# Altium schematic sheet P03_SOM CONNECTOR.SchDoc
size 594 x 420 mm
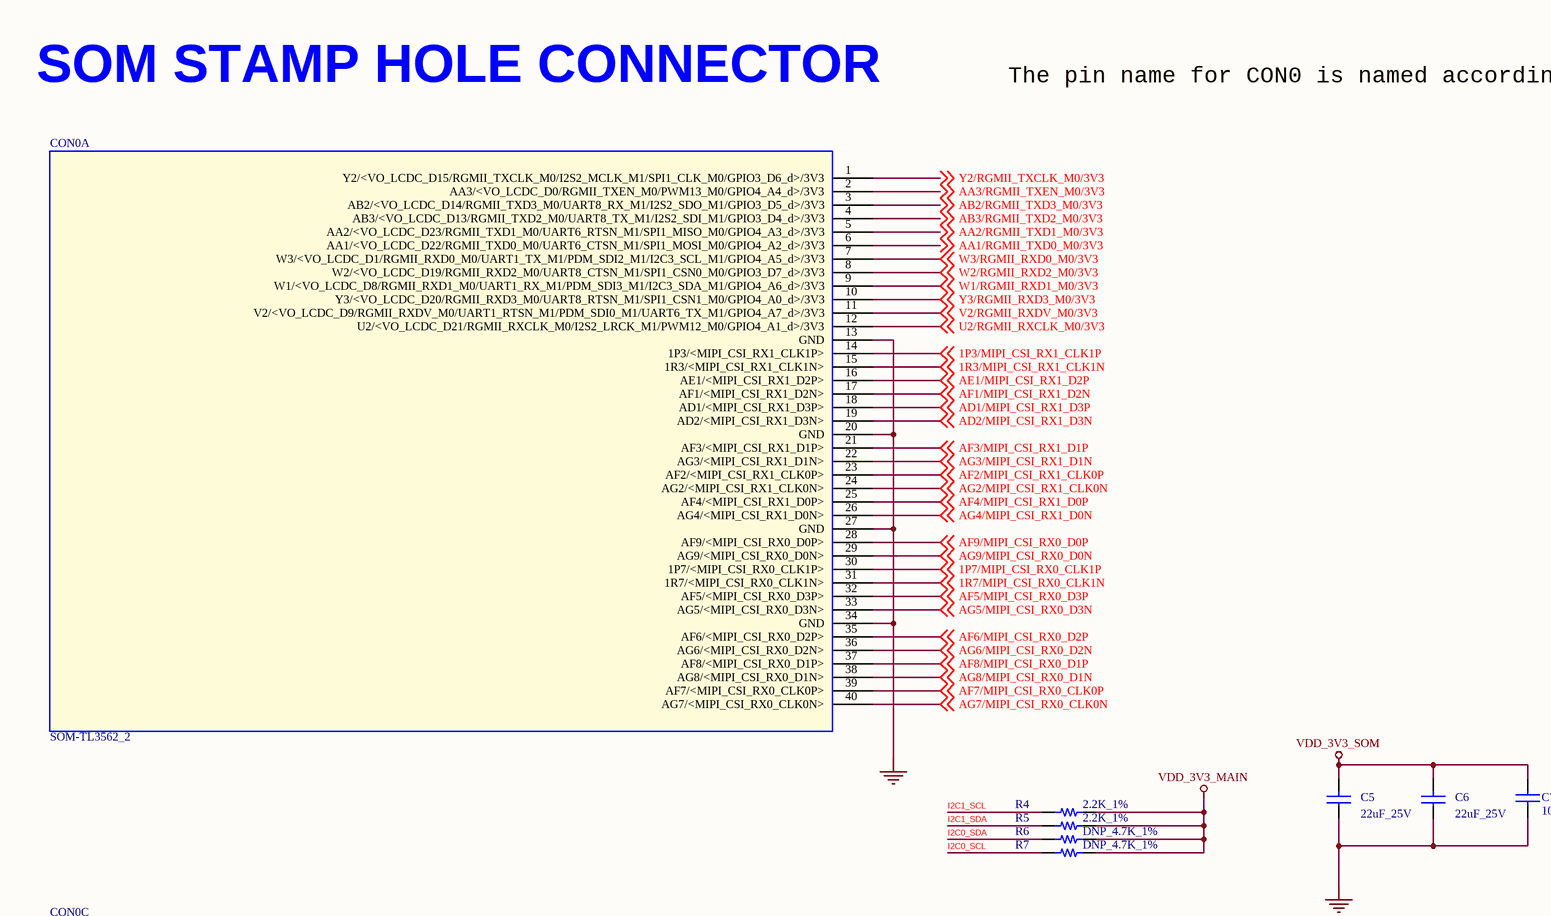
[diagram p0: P03_SOM CONNECTOR.SchDoc, top left]
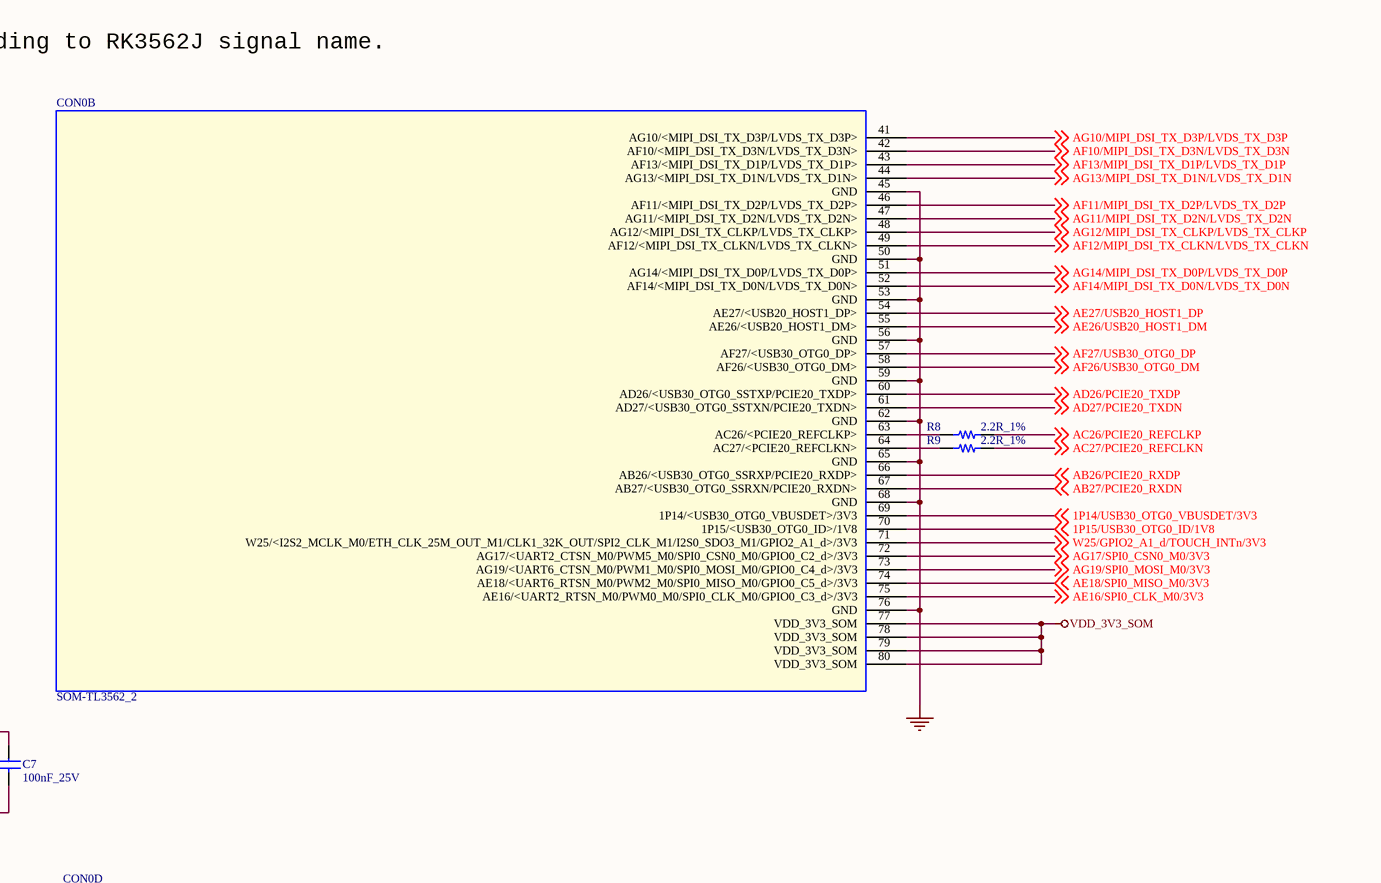
[diagram p1: P03_SOM CONNECTOR.SchDoc, top right]
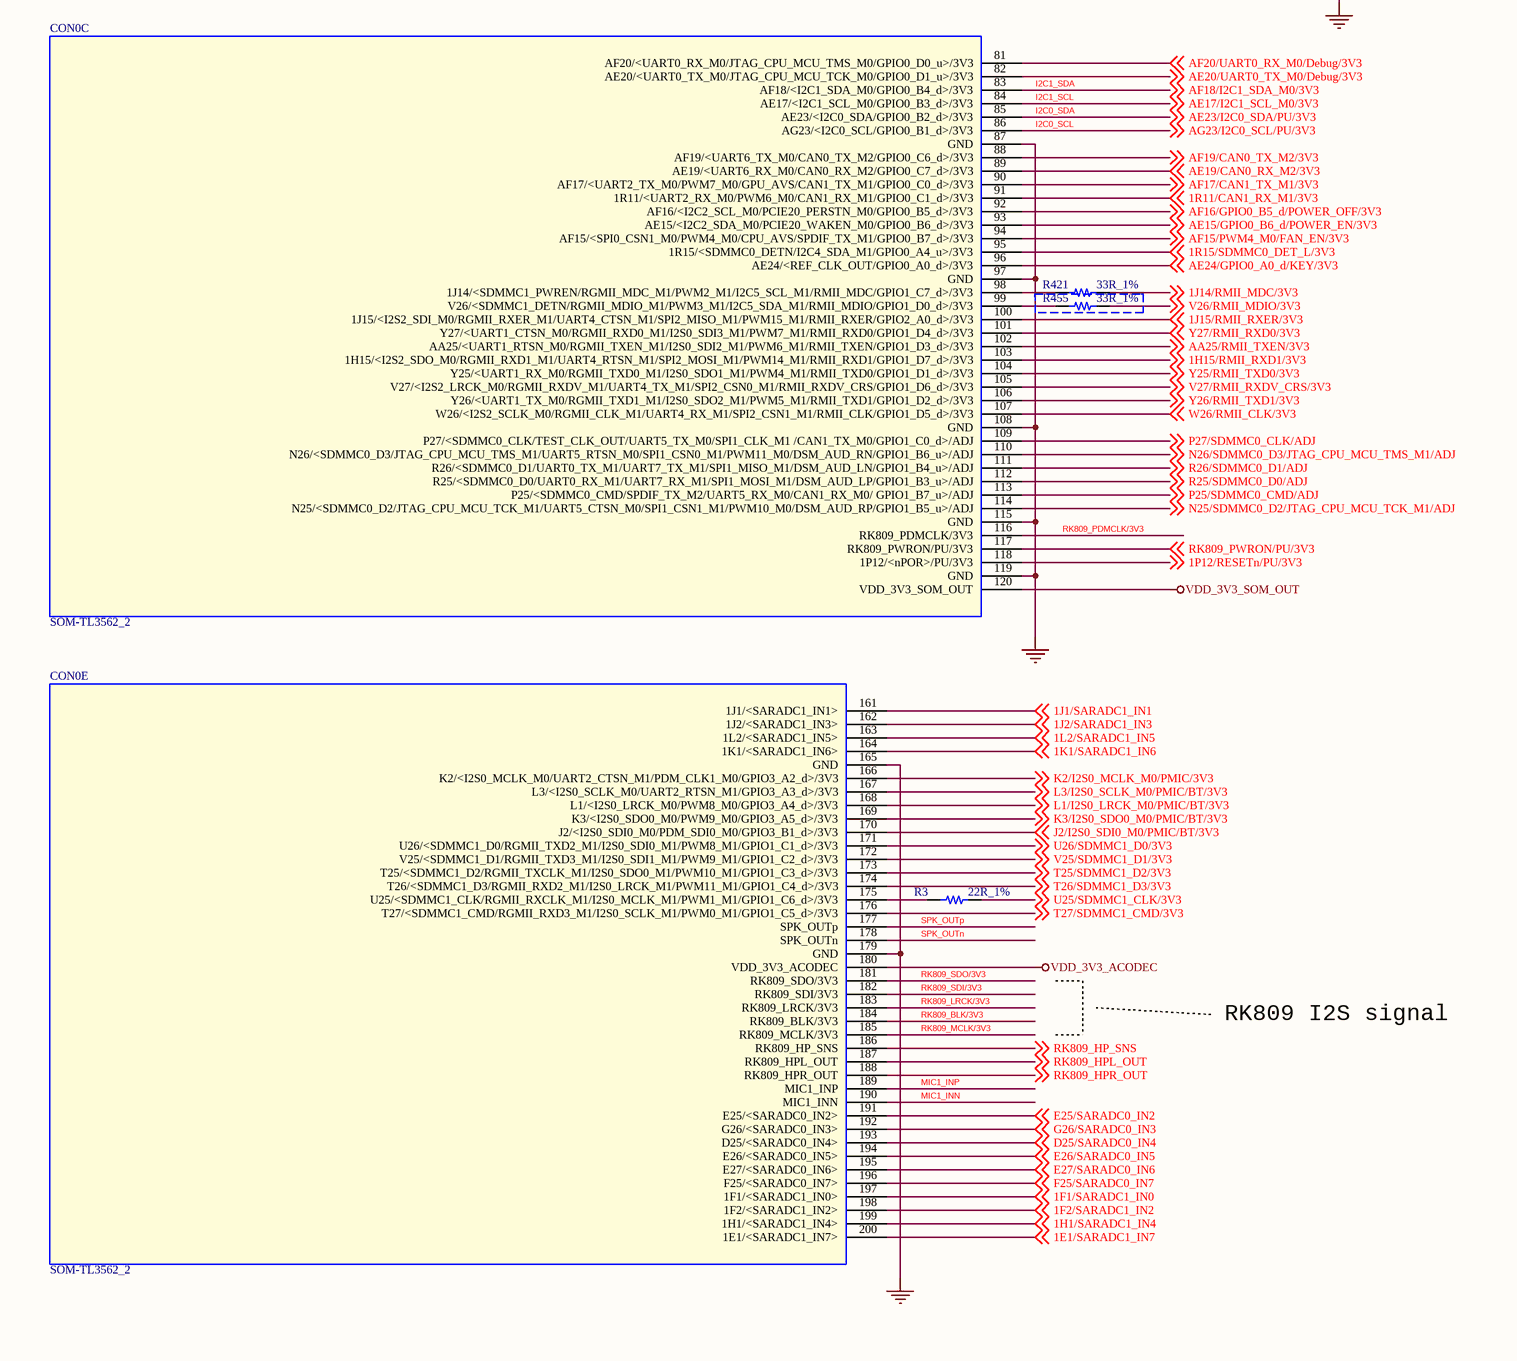
[diagram p2: P03_SOM CONNECTOR.SchDoc, bottom left]
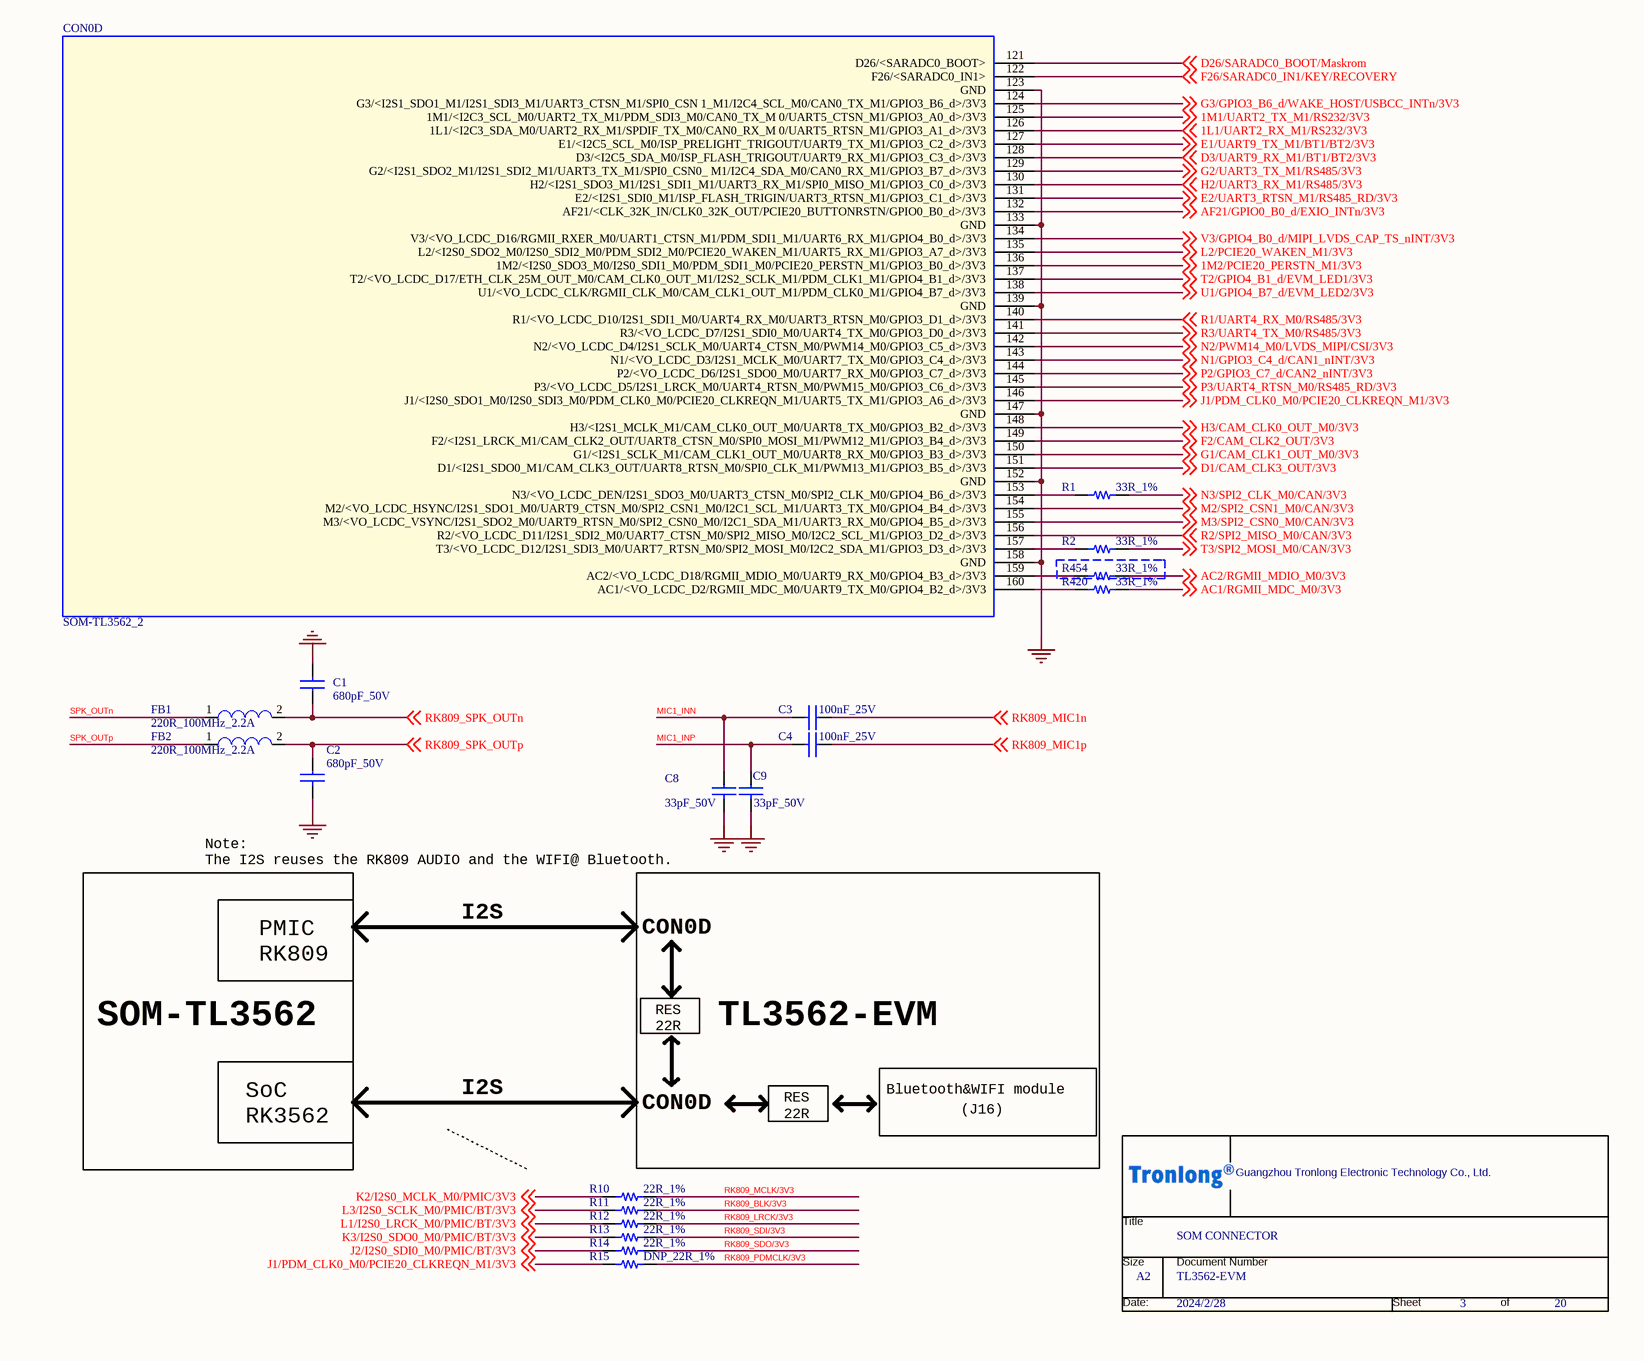
[diagram p3: P03_SOM CONNECTOR.SchDoc, bottom right]

## Parts
*  Page Count: 20  Page Number: 3  Page Size: A2  OrgName: Guangzhou Tronlong Electronic Technology Co., Ltd.  Title: SOM CONNECTOR  Doc: TL3562-EVM  Page Modify Date: 2024/2/28  (hidden comment: Tronlong_TITTLE_20211115)  (graphical)
C1  680pF_50V  [C0603]
C2  680pF_50V  [C0603]
C3  100nF_25V  [C0402]
C4  100nF_25V  [C0402]
C5  22uF_25V  [C0805]
C6  22uF_25V  [C0805]
C7  100nF_25V  [C0402]
C8  33pF_50V  [C0603]
C9  33pF_50V  [C0603]
CON0  SOM-TL3562_2  [SMD_200P_45x45_TL3562]  (parts A,B,C,D,E of 5)
FB1  220R_100MHz_2.2A  [L0603]
FB2  220R_100MHz_2.2A  [L0603]
R1  33R_1%  [R0402]
R2  33R_1%  [R0402]
R3  22R_1%  [R0402]
R4  2.2K_1%  [R0603]
R5  2.2K_1%  [R0603]
R6  DNP_4.7K_1%  [R0402]
R7  DNP_4.7K_1%  [R0402]
R8  2.2R_1%  [R0402]
R9  2.2R_1%  [R0402]
R10  22R_1%  [R0402]
R11  22R_1%  [R0402]
R12  22R_1%  [R0402]
R13  22R_1%  [R0402]
R14  22R_1%  [R0402]
R15  DNP_22R_1%  [R0402]
R420  33R_1%  [R0402]
R421  33R_1%  [R0402]
R454  33R_1%  [R0402]
R455  33R_1%  [R0402]

## Nets
GND: C1.2 C2.2 C5.1 C6.1 C7.2 C8.2 C9.2 CON0.13(GND) CON0.20(GND) CON0.27(GND) CON0.34(GND) CON0.45(GND) CON0.50(GND) CON0.53(GND) CON0.56(GND) CON0.59(GND) CON0.62(GND) CON0.65(GND) CON0.68(GND) CON0.76(GND) CON0.87(GND) CON0.97(GND) CON0.108(GND) CON0.115(GND) CON0.119(GND) CON0.123(GND) CON0.133(GND) CON0.139(GND) CON0.147(GND) CON0.152(GND) CON0.158(GND) CON0.165(GND) CON0.179(GND)
VDD_3V3_ACODEC: CON0.180(VDD_3V3_ACODEC)
VDD_3V3_MAIN: R4.2 R5.2 R6.2 R7.2
VDD_3V3_SOM: C5.2 C6.2 C7.1 CON0.77(VDD_3V3_SOM) CON0.78(VDD_3V3_SOM) CON0.79(VDD_3V3_SOM) CON0.80(VDD_3V3_SOM)
VDD_3V3_SOM_OUT: CON0.120(VDD_3V3_SOM_OUT)
1E1/SARADC1_IN7: CON0.200(1E1/<SARADC1_IN7>) ; off-sheet 1E1/SARADC1_IN7
1F1/SARADC1_IN0: CON0.197(1F1/<SARADC1_IN0>) ; off-sheet 1F1/SARADC1_IN0
1F2/SARADC1_IN2: CON0.198(1F2/<SARADC1_IN2>) ; off-sheet 1F2/SARADC1_IN2
1H1/SARADC1_IN4: CON0.199(1H1/<SARADC1_IN4>) ; off-sheet 1H1/SARADC1_IN4
1H15/RMII_RXD1/3V3: CON0.103(1H15/<I2S2_SDO_M0/RGMII_RXD1_M1/UART4_RTSN_M1/SPI2_MOSI_M1/PWM14_M1/RMII_RXD1/GPIO1_D7_d>/3V3) ; off-sheet 1H15/RMII_RXD1/3V3
1J1/SARADC1_IN1: CON0.161(1J1/<SARADC1_IN1>) ; off-sheet 1J1/SARADC1_IN1
1J2/SARADC1_IN3: CON0.162(1J2/<SARADC1_IN3>) ; off-sheet 1J2/SARADC1_IN3
1J14/RMII_MDC/3V3: R421.2 ; off-sheet 1J14/RMII_MDC/3V3
1J15/RMII_RXER/3V3: CON0.100(1J15/<I2S2_SDI_M0/RGMII_RXER_M1/UART4_CTSN_M1/SPI2_MISO_M1/PWM15_M1/RMII_RXER/GPIO2_A0_d>/3V3) ; off-sheet 1J15/RMII_RXER/3V3
1K1/SARADC1_IN6: CON0.164(1K1/<SARADC1_IN6>) ; off-sheet 1K1/SARADC1_IN6
1L1/UART2_RX_M1/RS232/3V3: CON0.126(1L1/<I2C3_SDA_M0/UART2_RX_M1/SPDIF_TX_M0/CAN0_RX_M
0/UART5_RTSN_M1/GPIO3_A1_d>/3V3) ; off-sheet 1L1/UART2_RX_M1/RS232/3V3
1L2/SARADC1_IN5: CON0.163(1L2/<SARADC1_IN5>) ; off-sheet 1L2/SARADC1_IN5
1M1/UART2_TX_M1/RS232/3V3: CON0.125(1M1/<I2C3_SCL_M0/UART2_TX_M1/PDM_SDI3_M0/CAN0_TX_M
0/UART5_CTSN_M1/GPIO3_A0_d>/3V3) ; off-sheet 1M1/UART2_TX_M1/RS232/3V3
1M2/PCIE20_PERSTN_M1/3V3: CON0.136(1M2/<I2S0_SDO3_M0/I2S0_SDI1_M0/PDM_SDI1_M0/PCIE20_PERSTN_M1/GPIO3_B0_d>/3V3) ; off-sheet 1M2/PCIE20_PERSTN_M1/3V3
1P3/MIPI_CSI_RX1_CLK1P: CON0.14(1P3/<MIPI_CSI_RX1_CLK1P>) ; off-sheet 1P3/MIPI_CSI_RX1_CLK1P
1P7/MIPI_CSI_RX0_CLK1P: CON0.30(1P7/<MIPI_CSI_RX0_CLK1P>) ; off-sheet 1P7/MIPI_CSI_RX0_CLK1P
1P12/RESETn/PU/3V3: CON0.118(1P12/<nPOR>/PU/3V3) ; off-sheet 1P12/RESETn/PU/3V3
1P14/USB30_OTG0_VBUSDET/3V3: CON0.69(1P14/<USB30_OTG0_VBUSDET>/3V3) ; off-sheet 1P14/USB30_OTG0_VBUSDET/3V3
1P15/USB30_OTG0_ID/1V8: CON0.70(1P15/<USB30_OTG0_ID>/1V8) ; off-sheet 1P15/USB30_OTG0_ID/1V8
1R3/MIPI_CSI_RX1_CLK1N: CON0.15(1R3/<MIPI_CSI_RX1_CLK1N>) ; off-sheet 1R3/MIPI_CSI_RX1_CLK1N
1R7/MIPI_CSI_RX0_CLK1N: CON0.31(1R7/<MIPI_CSI_RX0_CLK1N>) ; off-sheet 1R7/MIPI_CSI_RX0_CLK1N
1R11/CAN1_RX_M1/3V3: CON0.91(1R11/<UART2_RX_M0/PWM6_M0/CAN1_RX_M1/GPIO0_C1_d>/3V3) ; off-sheet 1R11/CAN1_RX_M1/3V3
1R15/SDMMC0_DET_L/3V3: CON0.95(1R15/<SDMMC0_DETN/I2C4_SDA_M1/GPIO0_A4_u>/3V3) ; off-sheet 1R15/SDMMC0_DET_L/3V3
AA1/RGMII_TXD0_M0/3V3: CON0.6(AA1/<VO_LCDC_D22/RGMII_TXD0_M0/UART6_CTSN_M1/SPI1_MOSI_M0/GPIO4_A2_d>/3V3) ; off-sheet AA1/RGMII_TXD0_M0/3V3
AA2/RGMII_TXD1_M0/3V3: CON0.5(AA2/<VO_LCDC_D23/RGMII_TXD1_M0/UART6_RTSN_M1/SPI1_MISO_M0/GPIO4_A3_d>/3V3) ; off-sheet AA2/RGMII_TXD1_M0/3V3
AA3/RGMII_TXEN_M0/3V3: CON0.2(AA3/<VO_LCDC_D0/RGMII_TXEN_M0/PWM13_M0/GPIO4_A4_d>/3V3) ; off-sheet AA3/RGMII_TXEN_M0/3V3
AA25/RMII_TXEN/3V3: CON0.102(AA25/<UART1_RTSN_M0/RGMII_TXEN_M1/I2S0_SDI2_M1/PWM6_M1/RMII_TXEN/GPIO1_D3_d>/3V3) ; off-sheet AA25/RMII_TXEN/3V3
AB2/RGMII_TXD3_M0/3V3: CON0.3(AB2/<VO_LCDC_D14/RGMII_TXD3_M0/UART8_RX_M1/I2S2_SDO_M1/GPIO3_D5_d>/3V3) ; off-sheet AB2/RGMII_TXD3_M0/3V3
AB3/RGMII_TXD2_M0/3V3: CON0.4(AB3/<VO_LCDC_D13/RGMII_TXD2_M0/UART8_TX_M1/I2S2_SDI_M1/GPIO3_D4_d>/3V3) ; off-sheet AB3/RGMII_TXD2_M0/3V3
AB26/PCIE20_RXDP: CON0.66(AB26/<USB30_OTG0_SSRXP/PCIE20_RXDP>) ; off-sheet AB26/PCIE20_RXDP
AB27/PCIE20_RXDN: CON0.67(AB27/<USB30_OTG0_SSRXN/PCIE20_RXDN>) ; off-sheet AB27/PCIE20_RXDN
AC1/RGMII_MDC_M0/3V3: R420.2 ; off-sheet AC1/RGMII_MDC_M0/3V3
AC2/RGMII_MDIO_M0/3V3: R454.2 ; off-sheet AC2/RGMII_MDIO_M0/3V3
AC26/PCIE20_REFCLKP: R8.2 ; off-sheet AC26/PCIE20_REFCLKP
AC27/PCIE20_REFCLKN: R9.2 ; off-sheet AC27/PCIE20_REFCLKN
AD1/MIPI_CSI_RX1_D3P: CON0.18(AD1/<MIPI_CSI_RX1_D3P>) ; off-sheet AD1/MIPI_CSI_RX1_D3P
AD2/MIPI_CSI_RX1_D3N: CON0.19(AD2/<MIPI_CSI_RX1_D3N>) ; off-sheet AD2/MIPI_CSI_RX1_D3N
AD26/PCIE20_TXDP: CON0.60(AD26/<USB30_OTG0_SSTXP/PCIE20_TXDP>) ; off-sheet AD26/PCIE20_TXDP
AD27/PCIE20_TXDN: CON0.61(AD27/<USB30_OTG0_SSTXN/PCIE20_TXDN>) ; off-sheet AD27/PCIE20_TXDN
AE1/MIPI_CSI_RX1_D2P: CON0.16(AE1/<MIPI_CSI_RX1_D2P>) ; off-sheet AE1/MIPI_CSI_RX1_D2P
AE15/GPIO0_B6_d/POWER_EN/3V3: CON0.93(AE15/<I2C2_SDA_M0/PCIE20_WAKEN_M0/GPIO0_B6_d>/3V3) ; off-sheet AE15/GPIO0_B6_d/POWER_EN/3V3
AE16/SPI0_CLK_M0/3V3: CON0.75(AE16/<UART2_RTSN_M0/PWM0_M0/SPI0_CLK_M0/GPIO0_C3_d>/3V3) ; off-sheet AE16/SPI0_CLK_M0/3V3
AE18/SPI0_MISO_M0/3V3: CON0.74(AE18/<UART6_RTSN_M0/PWM2_M0/SPI0_MISO_M0/GPIO0_C5_d>/3V3) ; off-sheet AE18/SPI0_MISO_M0/3V3
AE19/CAN0_RX_M2/3V3: CON0.89(AE19/<UART6_RX_M0/CAN0_RX_M2/GPIO0_C7_d>/3V3) ; off-sheet AE19/CAN0_RX_M2/3V3
AE20/UART0_TX_M0/Debug/3V3: CON0.82(AE20/<UART0_TX_M0/JTAG_CPU_MCU_TCK_M0/GPIO0_D1_u>/3V3) ; off-sheet AE20/UART0_TX_M0/Debug/3V3
AE24/GPIO0_A0_d/KEY/3V3: CON0.96(AE24/<REF_CLK_OUT/GPIO0_A0_d>/3V3) ; off-sheet AE24/GPIO0_A0_d/KEY/3V3
AE26/USB20_HOST1_DM: CON0.55(AE26/<USB20_HOST1_DM>) ; off-sheet AE26/USB20_HOST1_DM
AE27/USB20_HOST1_DP: CON0.54(AE27/<USB20_HOST1_DP>) ; off-sheet AE27/USB20_HOST1_DP
AF1/MIPI_CSI_RX1_D2N: CON0.17(AF1/<MIPI_CSI_RX1_D2N>) ; off-sheet AF1/MIPI_CSI_RX1_D2N
AF2/MIPI_CSI_RX1_CLK0P: CON0.23(AF2/<MIPI_CSI_RX1_CLK0P>) ; off-sheet AF2/MIPI_CSI_RX1_CLK0P
AF3/MIPI_CSI_RX1_D1P: CON0.21(AF3/<MIPI_CSI_RX1_D1P>) ; off-sheet AF3/MIPI_CSI_RX1_D1P
AF4/MIPI_CSI_RX1_D0P: CON0.25(AF4/<MIPI_CSI_RX1_D0P>) ; off-sheet AF4/MIPI_CSI_RX1_D0P
AF5/MIPI_CSI_RX0_D3P: CON0.32(AF5/<MIPI_CSI_RX0_D3P>) ; off-sheet AF5/MIPI_CSI_RX0_D3P
AF6/MIPI_CSI_RX0_D2P: CON0.35(AF6/<MIPI_CSI_RX0_D2P>) ; off-sheet AF6/MIPI_CSI_RX0_D2P
AF7/MIPI_CSI_RX0_CLK0P: CON0.39(AF7/<MIPI_CSI_RX0_CLK0P>) ; off-sheet AF7/MIPI_CSI_RX0_CLK0P
AF8/MIPI_CSI_RX0_D1P: CON0.37(AF8/<MIPI_CSI_RX0_D1P>) ; off-sheet AF8/MIPI_CSI_RX0_D1P
AF9/MIPI_CSI_RX0_D0P: CON0.28(AF9/<MIPI_CSI_RX0_D0P>) ; off-sheet AF9/MIPI_CSI_RX0_D0P
AF10/MIPI_DSI_TX_D3N/LVDS_TX_D3N: CON0.42(AF10/<MIPI_DSI_TX_D3N/LVDS_TX_D3N>) ; off-sheet AF10/MIPI_DSI_TX_D3N/LVDS_TX_D3N
AF11/MIPI_DSI_TX_D2P/LVDS_TX_D2P: CON0.46(AF11/<MIPI_DSI_TX_D2P/LVDS_TX_D2P>) ; off-sheet AF11/MIPI_DSI_TX_D2P/LVDS_TX_D2P
AF12/MIPI_DSI_TX_CLKN/LVDS_TX_CLKN: CON0.49(AF12/<MIPI_DSI_TX_CLKN/LVDS_TX_CLKN>) ; off-sheet AF12/MIPI_DSI_TX_CLKN/LVDS_TX_CLKN
AF13/MIPI_DSI_TX_D1P/LVDS_TX_D1P: CON0.43(AF13/<MIPI_DSI_TX_D1P/LVDS_TX_D1P>) ; off-sheet AF13/MIPI_DSI_TX_D1P/LVDS_TX_D1P
AF14/MIPI_DSI_TX_D0N/LVDS_TX_D0N: CON0.52(AF14/<MIPI_DSI_TX_D0N/LVDS_TX_D0N>) ; off-sheet AF14/MIPI_DSI_TX_D0N/LVDS_TX_D0N
AF15/PWM4_M0/FAN_EN/3V3: CON0.94(AF15/<SPI0_CSN1_M0/PWM4_M0/CPU_AVS/SPDIF_TX_M1/GPIO0_B7_d>/3V3) ; off-sheet AF15/PWM4_M0/FAN_EN/3V3
AF16/GPIO0_B5_d/POWER_OFF/3V3: CON0.92(AF16/<I2C2_SCL_M0/PCIE20_PERSTN_M0/GPIO0_B5_d>/3V3) ; off-sheet AF16/GPIO0_B5_d/POWER_OFF/3V3
AF17/CAN1_TX_M1/3V3: CON0.90(AF17/<UART2_TX_M0/PWM7_M0/GPU_AVS/CAN1_TX_M1/GPIO0_C0_d>/3V3) ; off-sheet AF17/CAN1_TX_M1/3V3
AF19/CAN0_TX_M2/3V3: CON0.88(AF19/<UART6_TX_M0/CAN0_TX_M2/GPIO0_C6_d>/3V3) ; off-sheet AF19/CAN0_TX_M2/3V3
AF20/UART0_RX_M0/Debug/3V3: CON0.81(AF20/<UART0_RX_M0/JTAG_CPU_MCU_TMS_M0/GPIO0_D0_u>/3V3) ; off-sheet AF20/UART0_RX_M0/Debug/3V3
AF21/GPIO0_B0_d/EXIO_INTn/3V3: CON0.132(AF21/<CLK_32K_IN/CLK0_32K_OUT/PCIE20_BUTTONRSTN/GPIO0_B0_d>/3V3) ; off-sheet AF21/GPIO0_B0_d/EXIO_INTn/3V3
AF26/USB30_OTG0_DM: CON0.58(AF26/<USB30_OTG0_DM>) ; off-sheet AF26/USB30_OTG0_DM
AF27/USB30_OTG0_DP: CON0.57(AF27/<USB30_OTG0_DP>) ; off-sheet AF27/USB30_OTG0_DP
AG2/MIPI_CSI_RX1_CLK0N: CON0.24(AG2/<MIPI_CSI_RX1_CLK0N>) ; off-sheet AG2/MIPI_CSI_RX1_CLK0N
AG3/MIPI_CSI_RX1_D1N: CON0.22(AG3/<MIPI_CSI_RX1_D1N>) ; off-sheet AG3/MIPI_CSI_RX1_D1N
AG4/MIPI_CSI_RX1_D0N: CON0.26(AG4/<MIPI_CSI_RX1_D0N>) ; off-sheet AG4/MIPI_CSI_RX1_D0N
AG5/MIPI_CSI_RX0_D3N: CON0.33(AG5/<MIPI_CSI_RX0_D3N>) ; off-sheet AG5/MIPI_CSI_RX0_D3N
AG6/MIPI_CSI_RX0_D2N: CON0.36(AG6/<MIPI_CSI_RX0_D2N>) ; off-sheet AG6/MIPI_CSI_RX0_D2N
AG7/MIPI_CSI_RX0_CLK0N: CON0.40(AG7/<MIPI_CSI_RX0_CLK0N>) ; off-sheet AG7/MIPI_CSI_RX0_CLK0N
AG8/MIPI_CSI_RX0_D1N: CON0.38(AG8/<MIPI_CSI_RX0_D1N>) ; off-sheet AG8/MIPI_CSI_RX0_D1N
AG9/MIPI_CSI_RX0_D0N: CON0.29(AG9/<MIPI_CSI_RX0_D0N>) ; off-sheet AG9/MIPI_CSI_RX0_D0N
AG10/MIPI_DSI_TX_D3P/LVDS_TX_D3P: CON0.41(AG10/<MIPI_DSI_TX_D3P/LVDS_TX_D3P>) ; off-sheet AG10/MIPI_DSI_TX_D3P/LVDS_TX_D3P
AG11/MIPI_DSI_TX_D2N/LVDS_TX_D2N: CON0.47(AG11/<MIPI_DSI_TX_D2N/LVDS_TX_D2N>) ; off-sheet AG11/MIPI_DSI_TX_D2N/LVDS_TX_D2N
AG12/MIPI_DSI_TX_CLKP/LVDS_TX_CLKP: CON0.48(AG12/<MIPI_DSI_TX_CLKP/LVDS_TX_CLKP>) ; off-sheet AG12/MIPI_DSI_TX_CLKP/LVDS_TX_CLKP
AG13/MIPI_DSI_TX_D1N/LVDS_TX_D1N: CON0.44(AG13/<MIPI_DSI_TX_D1N/LVDS_TX_D1N>) ; off-sheet AG13/MIPI_DSI_TX_D1N/LVDS_TX_D1N
AG14/MIPI_DSI_TX_D0P/LVDS_TX_D0P: CON0.51(AG14/<MIPI_DSI_TX_D0P/LVDS_TX_D0P>) ; off-sheet AG14/MIPI_DSI_TX_D0P/LVDS_TX_D0P
AG17/SPI0_CSN0_M0/3V3: CON0.72(AG17/<UART2_CTSN_M0/PWM5_M0/SPI0_CSN0_M0/GPIO0_C2_d>/3V3) ; off-sheet AG17/SPI0_CSN0_M0/3V3
AG19/SPI0_MOSI_M0/3V3: CON0.73(AG19/<UART6_CTSN_M0/PWM1_M0/SPI0_MOSI_M0/GPIO0_C4_d>/3V3) ; off-sheet AG19/SPI0_MOSI_M0/3V3
D1/CAM_CLK3_OUT/3V3: CON0.151(D1/<I2S1_SDO0_M1/CAM_CLK3_OUT/UART8_RTSN_M0/SPI0_CLK_M1/PWM13_M1/GPIO3_B5_d>/3V3) ; off-sheet D1/CAM_CLK3_OUT/3V3
D3/UART9_RX_M1/BT1/BT2/3V3: CON0.128(D3/<I2C5_SDA_M0/ISP_FLASH_TRIGOUT/UART9_RX_M1/GPIO3_C3_d>/3V3) ; off-sheet D3/UART9_RX_M1/BT1/BT2/3V3
D25/SARADC0_IN4: CON0.193(D25/<SARADC0_IN4>) ; off-sheet D25/SARADC0_IN4
D26/SARADC0_BOOT/Maskrom: CON0.121(D26/<SARADC0_BOOT>) ; off-sheet D26/SARADC0_BOOT/Maskrom
E1/UART9_TX_M1/BT1/BT2/3V3: CON0.127(E1/<I2C5_SCL_M0/ISP_PRELIGHT_TRIGOUT/UART9_TX_M1/GPIO3_C2_d>/3V3) ; off-sheet E1/UART9_TX_M1/BT1/BT2/3V3
E2/UART3_RTSN_M1/RS485_RD/3V3: CON0.131(E2/<I2S1_SDI0_M1/ISP_FLASH_TRIGIN/UART3_RTSN_M1/GPIO3_C1_d>/3V3) ; off-sheet E2/UART3_RTSN_M1/RS485_RD/3V3
E25/SARADC0_IN2: CON0.191(E25/<SARADC0_IN2>) ; off-sheet E25/SARADC0_IN2
E26/SARADC0_IN5: CON0.194(E26/<SARADC0_IN5>) ; off-sheet E26/SARADC0_IN5
E27/SARADC0_IN6: CON0.195(E27/<SARADC0_IN6>) ; off-sheet E27/SARADC0_IN6
F2/CAM_CLK2_OUT/3V3: CON0.149(F2/<I2S1_LRCK_M1/CAM_CLK2_OUT/UART8_CTSN_M0/SPI0_MOSI_M1/PWM12_M1/GPIO3_B4_d>/3V3) ; off-sheet F2/CAM_CLK2_OUT/3V3
F25/SARADC0_IN7: CON0.196(F25/<SARADC0_IN7>) ; off-sheet F25/SARADC0_IN7
F26/SARADC0_IN1/KEY/RECOVERY: CON0.122(F26/<SARADC0_IN1>) ; off-sheet F26/SARADC0_IN1/KEY/RECOVERY
G1/CAM_CLK1_OUT_M0/3V3: CON0.150(G1/<I2S1_SCLK_M1/CAM_CLK1_OUT_M0/UART8_RX_M0/GPIO3_B3_d>/3V3) ; off-sheet G1/CAM_CLK1_OUT_M0/3V3
G2/UART3_TX_M1/RS485/3V3: CON0.129(G2/<I2S1_SDO2_M1/I2S1_SDI2_M1/UART3_TX_M1/SPI0_CSN0_
M1/I2C4_SDA_M0/CAN0_RX_M1/GPIO3_B7_d>/3V3) ; off-sheet G2/UART3_TX_M1/RS485/3V3
G3/GPIO3_B6_d/WAKE_HOST/USBCC_INTn/3V3: CON0.124(G3/<I2S1_SDO1_M1/I2S1_SDI3_M1/UART3_CTSN_M1/SPI0_CSN
1_M1/I2C4_SCL_M0/CAN0_TX_M1/GPIO3_B6_d>/3V3) ; off-sheet G3/GPIO3_B6_d/WAKE_HOST/USBCC_INTn/3V3
G26/SARADC0_IN3: CON0.192(G26/<SARADC0_IN3>) ; off-sheet G26/SARADC0_IN3
H2/UART3_RX_M1/RS485/3V3: CON0.130(H2/<I2S1_SDO3_M1/I2S1_SDI1_M1/UART3_RX_M1/SPI0_MISO_M1/GPIO3_C0_d>/3V3) ; off-sheet H2/UART3_RX_M1/RS485/3V3
H3/CAM_CLK0_OUT_M0/3V3: CON0.148(H3/<I2S1_MCLK_M1/CAM_CLK0_OUT_M0/UART8_TX_M0/GPIO3_B2_d>/3V3) ; off-sheet H3/CAM_CLK0_OUT_M0/3V3
I2C0_SCL: CON0.86(AG23/<I2C0_SCL/GPIO0_B1_d>/3V3) R7.1 ; off-sheet AG23/I2C0_SCL/PU/3V3  [also labelled AG23/I2C0_SCL/PU/3V3]
I2C0_SDA: CON0.85(AE23/<I2C0_SDA/GPIO0_B2_d>/3V3) R6.1 ; off-sheet AE23/I2C0_SDA/PU/3V3  [also labelled AE23/I2C0_SDA/PU/3V3]
I2C1_SCL: CON0.84(AE17/<I2C1_SCL_M0/GPIO0_B3_d>/3V3) R4.1 ; off-sheet AE17/I2C1_SCL_M0/3V3  [also labelled AE17/I2C1_SCL_M0/3V3]
I2C1_SDA: CON0.83(AF18/<I2C1_SDA_M0/GPIO0_B4_d>/3V3) R5.1 ; off-sheet AF18/I2C1_SDA_M0/3V3  [also labelled AF18/I2C1_SDA_M0/3V3]
J1/PDM_CLK0_M0/PCIE20_CLKREQN_M1/3V3: CON0.146(J1/<I2S0_SDO1_M0/I2S0_SDI3_M0/PDM_CLK0_M0/PCIE20_CLKREQN_M1/UART5_TX_M1/GPIO3_A6_d>/3V3) R15.1 ; off-sheet J1/PDM_CLK0_M0/PCIE20_CLKREQN_M1/3V3
J2/I2S0_SDI0_M0/PMIC/BT/3V3: CON0.170(J2/<I2S0_SDI0_M0/PDM_SDI0_M0/GPIO3_B1_d>/3V3) R14.1 ; off-sheet J2/I2S0_SDI0_M0/PMIC/BT/3V3
K2/I2S0_MCLK_M0/PMIC/3V3: CON0.166(K2/<I2S0_MCLK_M0/UART2_CTSN_M1/PDM_CLK1_M0/GPIO3_A2_d>/3V3) R10.1 ; off-sheet K2/I2S0_MCLK_M0/PMIC/3V3
K3/I2S0_SDO0_M0/PMIC/BT/3V3: CON0.169(K3/<I2S0_SDO0_M0/PWM9_M0/GPIO3_A5_d>/3V3) R13.1 ; off-sheet K3/I2S0_SDO0_M0/PMIC/BT/3V3
L1/I2S0_LRCK_M0/PMIC/BT/3V3: CON0.168(L1/<I2S0_LRCK_M0/PWM8_M0/GPIO3_A4_d>/3V3) R12.1 ; off-sheet L1/I2S0_LRCK_M0/PMIC/BT/3V3
L2/PCIE20_WAKEN_M1/3V3: CON0.135(L2/<I2S0_SDO2_M0/I2S0_SDI2_M0/PDM_SDI2_M0/PCIE20_WAKEN_M1/UART5_RX_M1/GPIO3_A7_d>/3V3) ; off-sheet L2/PCIE20_WAKEN_M1/3V3
L3/I2S0_SCLK_M0/PMIC/BT/3V3: CON0.167(L3/<I2S0_SCLK_M0/UART2_RTSN_M1/GPIO3_A3_d>/3V3) R11.1 ; off-sheet L3/I2S0_SCLK_M0/PMIC/BT/3V3
M2/SPI2_CSN1_M0/CAN/3V3: CON0.154(M2/<VO_LCDC_HSYNC/I2S1_SDO1_M0/UART9_CTSN_M0/SPI2_CSN1_M0/I2C1_SCL_M1/UART3_TX_M0/GPIO4_B4_d>/3V3) ; off-sheet M2/SPI2_CSN1_M0/CAN/3V3
M3/SPI2_CSN0_M0/CAN/3V3: CON0.155(M3/<VO_LCDC_VSYNC/I2S1_SDO2_M0/UART9_RTSN_M0/SPI2_CSN0_M0/I2C1_SDA_M1/UART3_RX_M0/GPIO4_B5_d>/3V3) ; off-sheet M3/SPI2_CSN0_M0/CAN/3V3
MIC1_INN: C3.2 C8.1 CON0.190(MIC1_INN)
MIC1_INP: C4.2 C9.1 CON0.189(MIC1_INP)
N1/GPIO3_C4_d/CAN1_nINT/3V3: CON0.143(N1/<VO_LCDC_D3/I2S1_MCLK_M0/UART7_TX_M0/GPIO3_C4_d>/3V3) ; off-sheet N1/GPIO3_C4_d/CAN1_nINT/3V3
N2/PWM14_M0/LVDS_MIPI/CSI/3V3: CON0.142(N2/<VO_LCDC_D4/I2S1_SCLK_M0/UART4_CTSN_M0/PWM14_M0/GPIO3_C5_d>/3V3) ; off-sheet N2/PWM14_M0/LVDS_MIPI/CSI/3V3
N3/SPI2_CLK_M0/CAN/3V3: R1.2 ; off-sheet N3/SPI2_CLK_M0/CAN/3V3
N25/SDMMC0_D2/JTAG_CPU_MCU_TCK_M1/ADJ: CON0.114(N25/<SDMMC0_D2/JTAG_CPU_MCU_TCK_M1/UART5_CTSN_M0/SPI1_CSN1_M1/PWM10_M0/DSM_AUD_RP/GPIO1_B5_u>/ADJ) ; off-sheet N25/SDMMC0_D2/JTAG_CPU_MCU_TCK_M1/ADJ
N26/SDMMC0_D3/JTAG_CPU_MCU_TMS_M1/ADJ: CON0.110(N26/<SDMMC0_D3/JTAG_CPU_MCU_TMS_M1/UART5_RTSN_M0/SPI1_CSN0_M1/PWM11_M0/DSM_AUD_RN/GPIO1_B6_u>/ADJ) ; off-sheet N26/SDMMC0_D3/JTAG_CPU_MCU_TMS_M1/ADJ
P2/GPIO3_C7_d/CAN2_nINT/3V3: CON0.144(P2/<VO_LCDC_D6/I2S1_SDO0_M0/UART7_RX_M0/GPIO3_C7_d>/3V3) ; off-sheet P2/GPIO3_C7_d/CAN2_nINT/3V3
P3/UART4_RTSN_M0/RS485_RD/3V3: CON0.145(P3/<VO_LCDC_D5/I2S1_LRCK_M0/UART4_RTSN_M0/PWM15_M0/GPIO3_C6_d>/3V3) ; off-sheet P3/UART4_RTSN_M0/RS485_RD/3V3
P25/SDMMC0_CMD/ADJ: CON0.113(P25/<SDMMC0_CMD/SPDIF_TX_M2/UART5_RX_M0/CAN1_RX_M0/
GPIO1_B7_u>/ADJ) ; off-sheet P25/SDMMC0_CMD/ADJ
P27/SDMMC0_CLK/ADJ: CON0.109(P27/<SDMMC0_CLK/TEST_CLK_OUT/UART5_TX_M0/SPI1_CLK_M1
/CAN1_TX_M0/GPIO1_C0_d>/ADJ) ; off-sheet P27/SDMMC0_CLK/ADJ
R1/UART4_RX_M0/RS485/3V3: CON0.140(R1/<VO_LCDC_D10/I2S1_SDI1_M0/UART4_RX_M0/UART3_RTSN_M0/GPIO3_D1_d>/3V3) ; off-sheet R1/UART4_RX_M0/RS485/3V3
R2/SPI2_MISO_M0/CAN/3V3: CON0.156(R2/<VO_LCDC_D11/I2S1_SDI2_M0/UART7_CTSN_M0/SPI2_MISO_M0/I2C2_SCL_M1/GPIO3_D2_d>/3V3) ; off-sheet R2/SPI2_MISO_M0/CAN/3V3
R3/UART4_TX_M0/RS485/3V3: CON0.141(R3/<VO_LCDC_D7/I2S1_SDI0_M0/UART4_TX_M0/GPIO3_D0_d>/3V3) ; off-sheet R3/UART4_TX_M0/RS485/3V3
R25/SDMMC0_D0/ADJ: CON0.112(R25/<SDMMC0_D0/UART0_RX_M1/UART7_RX_M1/SPI1_MOSI_M1/DSM_AUD_LP/GPIO1_B3_u>/ADJ) ; off-sheet R25/SDMMC0_D0/ADJ
R26/SDMMC0_D1/ADJ: CON0.111(R26/<SDMMC0_D1/UART0_TX_M1/UART7_TX_M1/SPI1_MISO_M1/DSM_AUD_LN/GPIO1_B4_u>/ADJ) ; off-sheet R26/SDMMC0_D1/ADJ
RK809_BLK/3V3: CON0.184(RK809_BLK/3V3) R11.2
RK809_HP_SNS: CON0.186(RK809_HP_SNS) ; off-sheet RK809_HP_SNS
RK809_HPL_OUT: CON0.187(RK809_HPL_OUT) ; off-sheet RK809_HPL_OUT
RK809_HPR_OUT: CON0.188(RK809_HPR_OUT) ; off-sheet RK809_HPR_OUT
RK809_LRCK/3V3: CON0.183(RK809_LRCK/3V3) R12.2
RK809_MCLK/3V3: CON0.185(RK809_MCLK/3V3) R10.2
RK809_MIC1n: C3.1 ; off-sheet RK809_MIC1n
RK809_MIC1p: C4.1 ; off-sheet RK809_MIC1p
RK809_PDMCLK/3V3: CON0.116(RK809_PDMCLK/3V3) R15.2
RK809_PWRON/PU/3V3: CON0.117(RK809_PWRON/PU/3V3) ; off-sheet RK809_PWRON/PU/3V3
RK809_SDI/3V3: CON0.182(RK809_SDI/3V3) R13.2
RK809_SDO/3V3: CON0.181(RK809_SDO/3V3) R14.2
RK809_SPK_OUTn: C1.1 FB1.2 ; off-sheet RK809_SPK_OUTn
RK809_SPK_OUTp: C2.1 FB2.2 ; off-sheet RK809_SPK_OUTp
SPK_OUTn: CON0.178(SPK_OUTn) FB1.1
SPK_OUTp: CON0.177(SPK_OUTp) FB2.1
T2/GPIO4_B1_d/EVM_LED1/3V3: CON0.137(T2/<VO_LCDC_D17/ETH_CLK_25M_OUT_M0/CAM_CLK0_OUT_M1/I2S2_SCLK_M1/PDM_CLK1_M1/GPIO4_B1_d>/3V3) ; off-sheet T2/GPIO4_B1_d/EVM_LED1/3V3
T3/SPI2_MOSI_M0/CAN/3V3: R2.2 ; off-sheet T3/SPI2_MOSI_M0/CAN/3V3
T25/SDMMC1_D2/3V3: CON0.173(T25/<SDMMC1_D2/RGMII_TXCLK_M1/I2S0_SDO0_M1/PWM10_M1/GPIO1_C3_d>/3V3) ; off-sheet T25/SDMMC1_D2/3V3
T26/SDMMC1_D3/3V3: CON0.174(T26/<SDMMC1_D3/RGMII_RXD2_M1/I2S0_LRCK_M1/PWM11_M1/GPIO1_C4_d>/3V3) ; off-sheet T26/SDMMC1_D3/3V3
T27/SDMMC1_CMD/3V3: CON0.176(T27/<SDMMC1_CMD/RGMII_RXD3_M1/I2S0_SCLK_M1/PWM0_M1/GPIO1_C5_d>/3V3) ; off-sheet T27/SDMMC1_CMD/3V3
U1/GPIO4_B7_d/EVM_LED2/3V3: CON0.138(U1/<VO_LCDC_CLK/RGMII_CLK_M0/CAM_CLK1_OUT_M1/PDM_CLK0_M1/GPIO4_B7_d>/3V3) ; off-sheet U1/GPIO4_B7_d/EVM_LED2/3V3
U2/RGMII_RXCLK_M0/3V3: CON0.12(U2/<VO_LCDC_D21/RGMII_RXCLK_M0/I2S2_LRCK_M1/PWM12_M0/GPIO4_A1_d>/3V3) ; off-sheet U2/RGMII_RXCLK_M0/3V3
U25/SDMMC1_CLK/3V3: R3.2 ; off-sheet U25/SDMMC1_CLK/3V3
U26/SDMMC1_D0/3V3: CON0.171(U26/<SDMMC1_D0/RGMII_TXD2_M1/I2S0_SDI0_M1/PWM8_M1/GPIO1_C1_d>/3V3) ; off-sheet U26/SDMMC1_D0/3V3
V2/RGMII_RXDV_M0/3V3: CON0.11(V2/<VO_LCDC_D9/RGMII_RXDV_M0/UART1_RTSN_M1/PDM_SDI0_M1/UART6_TX_M1/GPIO4_A7_d>/3V3) ; off-sheet V2/RGMII_RXDV_M0/3V3
V3/GPIO4_B0_d/MIPI_LVDS_CAP_TS_nINT/3V3: CON0.134(V3/<VO_LCDC_D16/RGMII_RXER_M0/UART1_CTSN_M1/PDM_SDI1_M1/UART6_RX_M1/GPIO4_B0_d>/3V3) ; off-sheet V3/GPIO4_B0_d/MIPI_LVDS_CAP_TS_nINT/3V3
V25/SDMMC1_D1/3V3: CON0.172(V25/<SDMMC1_D1/RGMII_TXD3_M1/I2S0_SDI1_M1/PWM9_M1/GPIO1_C2_d>/3V3) ; off-sheet V25/SDMMC1_D1/3V3
V26/RMII_MDIO/3V3: R455.2 ; off-sheet V26/RMII_MDIO/3V3
V27/RMII_RXDV_CRS/3V3: CON0.105(V27/<I2S2_LRCK_M0/RGMII_RXDV_M1/UART4_TX_M1/SPI2_CSN0_M1/RMII_RXDV_CRS/GPIO1_D6_d>/3V3) ; off-sheet V27/RMII_RXDV_CRS/3V3
W1/RGMII_RXD1_M0/3V3: CON0.9(W1/<VO_LCDC_D8/RGMII_RXD1_M0/UART1_RX_M1/PDM_SDI3_M1/I2C3_SDA_M1/GPIO4_A6_d>/3V3) ; off-sheet W1/RGMII_RXD1_M0/3V3
W2/RGMII_RXD2_M0/3V3: CON0.8(W2/<VO_LCDC_D19/RGMII_RXD2_M0/UART8_CTSN_M1/SPI1_CSN0_M0/GPIO3_D7_d>/3V3) ; off-sheet W2/RGMII_RXD2_M0/3V3
W3/RGMII_RXD0_M0/3V3: CON0.7(W3/<VO_LCDC_D1/RGMII_RXD0_M0/UART1_TX_M1/PDM_SDI2_M1/I2C3_SCL_M1/GPIO4_A5_d>/3V3) ; off-sheet W3/RGMII_RXD0_M0/3V3
W25/GPIO2_A1_d/TOUCH_INTn/3V3: CON0.71(W25/<I2S2_MCLK_M0/ETH_CLK_25M_OUT_M1/CLK1_32K_OUT/SPI2_CLK_M1/I2S0_SDO3_M1/GPIO2_A1_d>/3V3) ; off-sheet W25/GPIO2_A1_d/TOUCH_INTn/3V3
W26/RMII_CLK/3V3: CON0.107(W26/<I2S2_SCLK_M0/RGMII_CLK_M1/UART4_RX_M1/SPI2_CSN1_M1/RMII_CLK/GPIO1_D5_d>/3V3) ; off-sheet W26/RMII_CLK/3V3
Y2/RGMII_TXCLK_M0/3V3: CON0.1(Y2/<VO_LCDC_D15/RGMII_TXCLK_M0/I2S2_MCLK_M1/SPI1_CLK_M0/GPIO3_D6_d>/3V3) ; off-sheet Y2/RGMII_TXCLK_M0/3V3
Y3/RGMII_RXD3_M0/3V3: CON0.10(Y3/<VO_LCDC_D20/RGMII_RXD3_M0/UART8_RTSN_M1/SPI1_CSN1_M0/GPIO4_A0_d>/3V3) ; off-sheet Y3/RGMII_RXD3_M0/3V3
Y25/RMII_TXD0/3V3: CON0.104(Y25/<UART1_RX_M0/RGMII_TXD0_M1/I2S0_SDO1_M1/PWM4_M1/RMII_TXD0/GPIO1_D1_d>/3V3) ; off-sheet Y25/RMII_TXD0/3V3
Y26/RMII_TXD1/3V3: CON0.106(Y26/<UART1_TX_M0/RGMII_TXD1_M1/I2S0_SDO2_M1/PWM5_M1/RMII_TXD1/GPIO1_D2_d>/3V3) ; off-sheet Y26/RMII_TXD1/3V3
Y27/RMII_RXD0/3V3: CON0.101(Y27/<UART1_CTSN_M0/RGMII_RXD0_M1/I2S0_SDI3_M1/PWM7_M1/RMII_RXD0/GPIO1_D4_d>/3V3) ; off-sheet Y27/RMII_RXD0/3V3
NetCON0_63: CON0.63(AC26/<PCIE20_REFCLKP>) R8.1
NetCON0_64: CON0.64(AC27/<PCIE20_REFCLKN>) R9.1
NetCON0_98: CON0.98(1J14/<SDMMC1_PWREN/RGMII_MDC_M1/PWM2_M1/I2C5_SCL_M1/RMII_MDC/GPIO1_C7_d>/3V3) R421.1
NetCON0_99: CON0.99(V26/<SDMMC1_DETN/RGMII_MDIO_M1/PWM3_M1/I2C5_SDA_M1/RMII_MDIO/GPIO1_D0_d>/3V3) R455.1
NetCON0_153: CON0.153(N3/<VO_LCDC_DEN/I2S1_SDO3_M0/UART3_CTSN_M0/SPI2_CLK_M0/GPIO4_B6_d>/3V3) R1.1
NetCON0_157: CON0.157(T3/<VO_LCDC_D12/I2S1_SDI3_M0/UART7_RTSN_M0/SPI2_MOSI_M0/I2C2_SDA_M1/GPIO3_D3_d>/3V3) R2.1
NetCON0_159: CON0.159(AC2/<VO_LCDC_D18/RGMII_MDIO_M0/UART9_RX_M0/GPIO4_B3_d>/3V3) R454.1
NetCON0_160: CON0.160(AC1/<VO_LCDC_D2/RGMII_MDC_M0/UART9_TX_M0/GPIO4_B2_d>/3V3) R420.1
NetCON0_175: CON0.175(U25/<SDMMC1_CLK/RGMII_RXCLK_M1/I2S0_MCLK_M1/PWM1_M1/GPIO1_C6_d>/3V3) R3.1

## Notes on the sheet
- SOM STAMP HOLE CONNECTOR
- The pin name for CON0 is named according to RK3562J signal name.
- Note:
  The I2S reuses the RK809 AUDIO and the WIFI@ Bluetooth.
- I2S
- CON0D
- PMIC
  RK809
- RK809 I2S signal
- SOM-TL3562
- RES
  22R
- TL3562-EVM
- SoC
  RK3562
- Bluetooth&WIFI module
- (J16)
- (in symbol Tronlong_TITTLE_20211115) Title; Size; Document Number; Date:; Sheet; of

## Library data of the parts
* = Tronlong_TITTLE_20211115: RevCode: A?; Page Create Date: March  8, 1995
C1 = CAP NP_Dup3: 贴片陶瓷电容,680pF,5%,50V,COG; Manufacturer PN: C1005C0G1H681J050BA; Manufacturer Character: 中国大陆; Dielectric: C0G; Priority: A; Operation Temperature（℃）: -55~125℃; As-Welded: /; Created by: JJJ; Tolerance: 5%; Voltage: 50V; Part Type: C0402; RK PN: C1005C0G1H681J050BA; PCB Footprint: C0603
C2 = CAP NP_Dup3: 贴片陶瓷电容,680pF,5%,50V,COG; Manufacturer Character: 中国大陆; RK PN: C1005C0G1H681J050BA; Priority: A; Dielectric: C0G; Operation Temperature（℃）: -55~125℃; As-Welded: /; Part Type: C0402; Voltage: 50V; Tolerance: 5%; Manufacturer PN: C1005C0G1H681J050BA; Created by: JJJ; PCB Footprint: C0603
C3 = CAP NP_Dup3: 贴片陶瓷电容,100nF,10%,25V,X5R; Manufacturer Character: 中国大陆; Operation Temperature（℃）: -55~85℃; RK PN: C1005X5R1A104K050BA; Priority: A; Voltage: 10V; As-Welded: /; Part Type: C0402; Dielectric: X5R; Tolerance: 10%; Manufacturer PN: C1005X5R1A104K050BA; Created by: JJJ; PCB Footprint: C0402
C4 = CAP NP_Dup3: 贴片陶瓷电容,100nF,10%,25V,X5R; Manufacturer Character: 中国大陆; Manufacturer PN: C1005X5R1A104K050BA; Operation Temperature（℃）: -55~85℃; Voltage: 10V; Priority: A; As-Welded: /; Created by: JJJ; Tolerance: 10%; Dielectric: X5R; Part Type: C0402; RK PN: C1005X5R1A104K050BA; PCB Footprint: C0402
C5 C6 = CAP NP: 贴片陶瓷电容,22uF,20%,25V,X5R; Manufacturer PN: C2012X5R1A226K125AB; Manufacturer Character: 中国大陆; Operation Temperature（℃）: -55~85℃; As-Welded: /; Tolerance: 10%; Voltage: 10V; Priority: A; Created by: JJJ; Dielectric: X5R; Part Type: C0805; RK PN: C2012X5R1A226K125AB; PCB Footprint: C0805
C7 = CAP NP: 贴片陶瓷电容,100nF,10%,25V,X5R; Manufacturer Character: 中国大陆; RK PN: C1005X5R1A104K050BA; Priority: A; Voltage: 10V; As-Welded: /; Operation Temperature（℃）: -55~85℃; Part Type: C0402; Dielectric: X5R; Tolerance: 10%; Manufacturer PN: C1005X5R1A104K050BA; Created by: JJJ; PCB Footprint: C0402
C8 = CAP NP_Dup3: 贴片陶瓷电容,33pF,5%,50V,COG; Manufacturer Character: 中国大陆; Option: DNP; RK PN: C1005C0G1H270J050BA; Priority: A; Dielectric: C0G; As-Welded: /; Operation Temperature（℃）: -55~125℃; Part Type: C0402; Voltage: 50V; Tolerance: 5%; Manufacturer PN: C1005C0G1H270J050BA; Created by: JJJ; PCB Footprint: C0603
C9 = CAP NP_Dup3: 贴片陶瓷电容,33pF,5%,50V,COG; Manufacturer Character: 中国大陆; Operation Temperature（℃）: -55~125℃; Option: DNP; RK PN: C1005C0G1H270J050BA; Priority: A; Dielectric: C0G; As-Welded: /; Part Type: C0402; Voltage: 50V; Tolerance: 5%; Manufacturer PN: C1005C0G1H270J050BA; Created by: JJJ; PCB Footprint: C0603
CON0 = SOM-TL3562_2: Manufacturer Character: 中国大陆; Manufacturer: 广州创龙电子科技有限公司（Tronlong）; As-Welded: /; Operation Temperature（℃）: -40~85℃; Manufacturer PartNumber: SMD_200P_45x45_TL3562; PCB Footprint: SMD_200P_45x45_TL3562
FB1 = BEAD: 磁珠,50mΩ,2.2A,220R@100MHz; Manufacturer Character: 中国大陆; Manufacturer PartNumber: UPZ1608U221-2R2TF; Manufacturer: 深圳顺络电子股份有限公司（Sunlord）; As-Welded: /; RK PN: BLM18PG181SN1; Priority: A; Operation Temperature（℃）: -55~125℃; PCB Footprint: L0603; Temperature: -55~+125(Ta); Part Type: BEAD; Manufacturer PN: BLM18PG181SN1; Created by: YTL
FB2 = BEAD: 磁珠,50mΩ,2.2A,220R@100MHz; Manufacturer PN: BLM18PG181SN1; Manufacturer: 深圳顺络电子股份有限公司（Sunlord）; Manufacturer PartNumber: UPZ1608U221-2R2TF; Manufacturer Character: 中国大陆; As-Welded: /; Operation Temperature（℃）: -55~125℃; Priority: A; PCB Footprint: L0603; Created by: YTL; Part Type: BEAD; RK PN: BLM18PG181SN1; Temperature: -55~+125(Ta)
R1 R420 R421 R454 = Resistor_Dup3: 贴片电阻,33R,±1%,1/16W; Manufacturer Character: 中国大陆; CLASS: DISCRETE; As-Welded: /; room: RGMII1; Operation Temperature（℃）: -55~155℃; Temperature: -55~125℃; PCB Footprint: R0402
R2 = Resistor_Dup3: 贴片电阻,33R,±1%,1/16W; Manufacturer Character: 中国大陆; CLASS: DISCRETE; room: RGMII1; Operation Temperature（℃）: -55~155℃; As-Welded: /; Temperature: -55~125℃; PCB Footprint: R0402
R3 R10-R14 = Resistor_Dup3: 贴片电阻,22R,±1%,1/16W; Manufacturer Character: 中国大陆; CLASS: DISCRETE; Operation Temperature（℃）: -55~155℃; room: RGMII1; As-Welded: /; PCB Footprint: R0402
  R3: Temperature: -55~125℃
R4 R5 = Resistor_Dup3: 贴片电阻,2.2K,±1%,1/10W; Manufacturer Character: 中国大陆; CLASS: DISCRETE; As-Welded: /; Operation Temperature（℃）: -55~155℃; room: DCIN; PCB Footprint: R0603
R6 R7 = Resistor_Dup3: 贴片电阻,4.7K,±1%,1/16W; Manufacturer Character: 中国大陆; CLASS: DISCRETE; As-Welded: DNP; room: DCIN; Operation Temperature（℃）: -55~155℃; PCB Footprint: R0402
R8 R9 = Resistor_Dup3: 贴片电阻,2.2R,±1%,1/16W; Manufacturer Character: 中国大陆; CLASS: DISCRETE; room: RGMII1; Operation Temperature（℃）: -55~155℃; As-Welded: /; PCB Footprint: R0402
R15 = Resistor_Dup3: 贴片电阻,22R,±1%,1/16W; Manufacturer Character: 中国大陆; CLASS: DISCRETE; As-Welded: DNP; room: RGMII1; Operation Temperature（℃）: -55~155℃; PCB Footprint: R0402
R455 = Resistor_Dup3: 贴片电阻,33R,±1%,1/16W; Manufacturer Character: 中国大陆; CLASS: DISCRETE; Operation Temperature（℃）: -55~155℃; room: RGMII1; As-Welded: /; Temperature: -55~125℃; PCB Footprint: R0402